# Altium project CabinTempSenseHardware2.PrjPcb
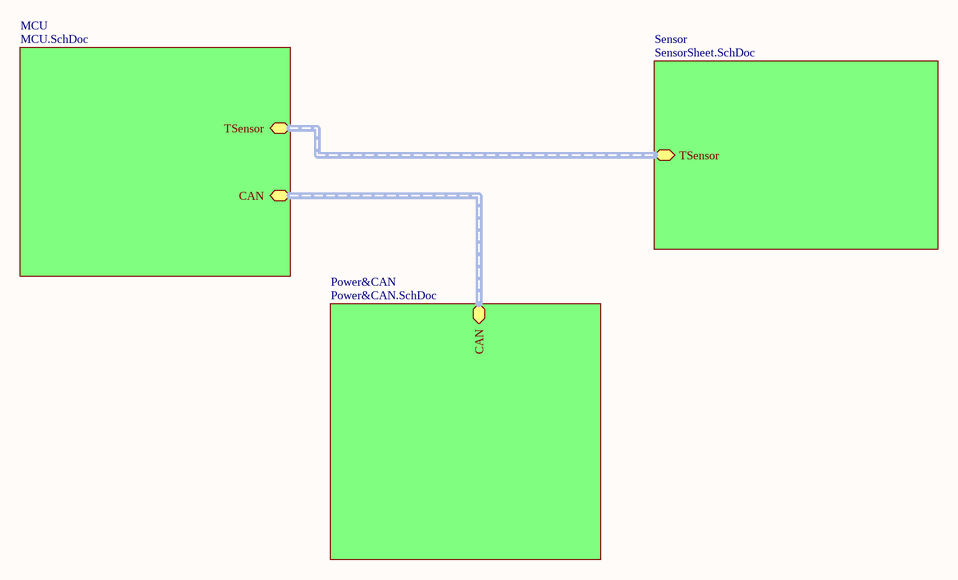
[diagram p0: MainBoard.SchDoc]
4 sheets, 25 parts. Net scope: hierarchical (ports join the sheet entries above them; power ports are global).
Board file: CabinTempSenseHardware2.PcbDoc
Sheets:
  MainBoard.SchDoc
    MCU = MCU.SchDoc
    Sensor = SensorSheet.SchDoc
    Power&CAN = Power&CAN.SchDoc

## Sheet MainBoard.SchDoc
size A4

### Sub-sheets
MCU = MCU.SchDoc: TSensor (harness Sensor), CAN (harness CanHarness)
Power&CAN = Power&CAN.SchDoc: CAN (harness CanHarness)
Sensor = SensorSheet.SchDoc: TSensor (harness Sensor)

### Buses and harness runs
harness sheet MCU/CAN = sheet Power&CAN/CAN
harness sheet MCU/TSensor = sheet Sensor/TSensor

## Sheet MCU.SchDoc
size A4
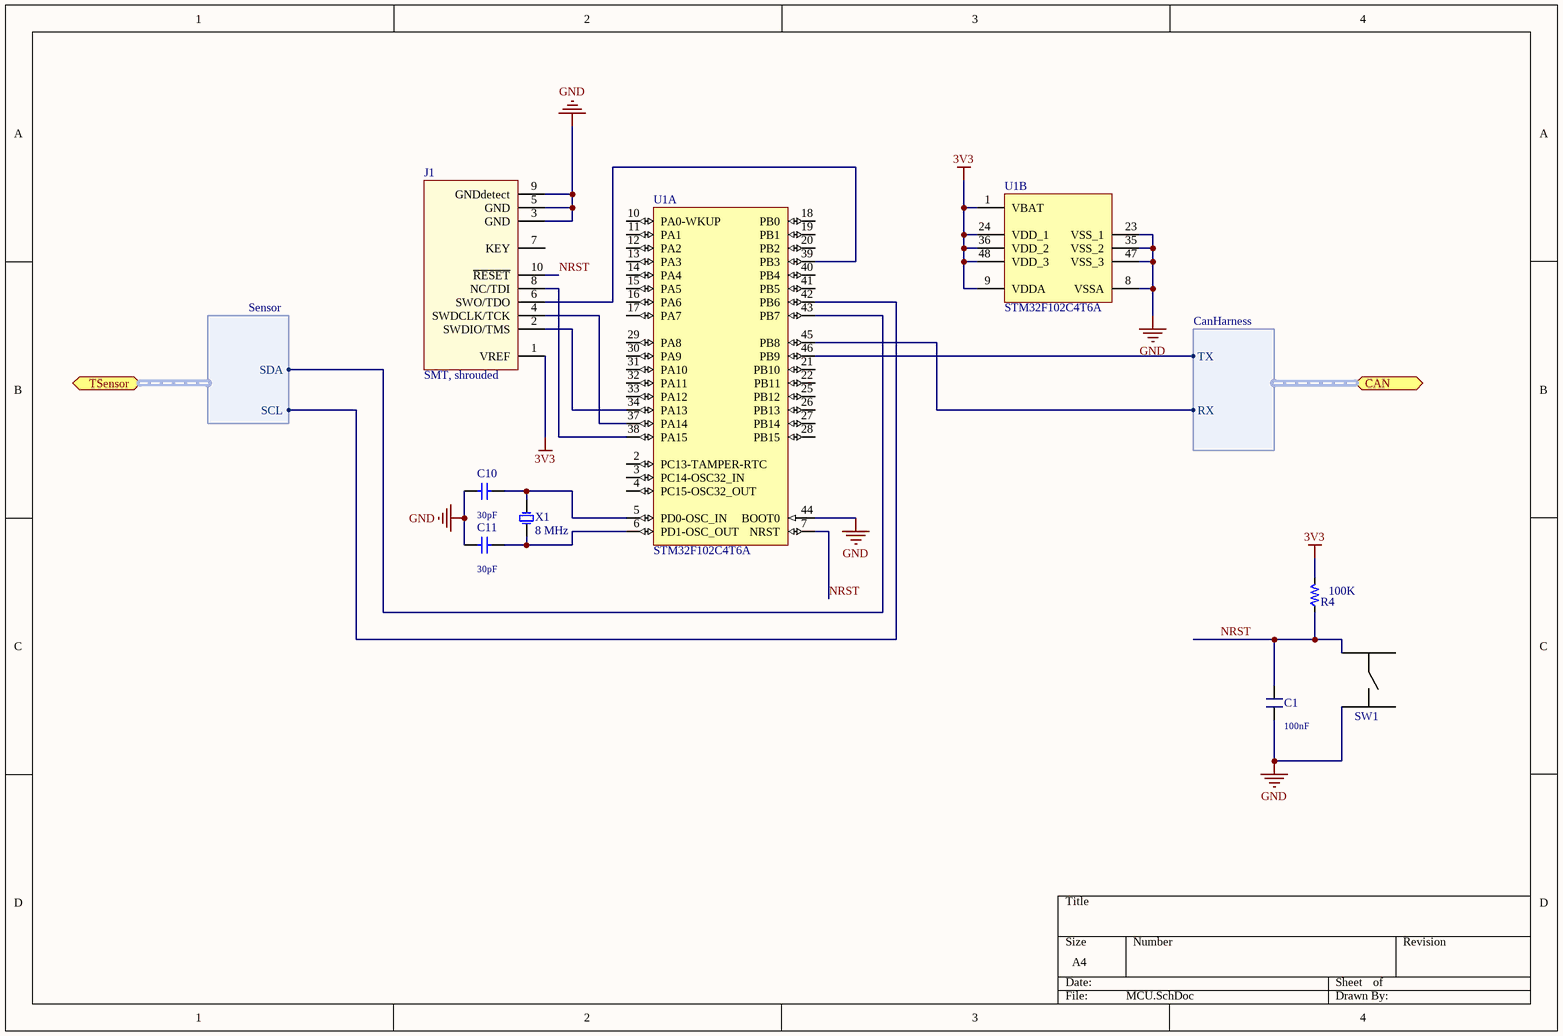
[diagram p1: MCU.SchDoc]

### Parts
C1  Capacitance: 100nF  [PCB_GENERIC_SMD_0603]  (hidden comment: SCH_GENERIC_CAPACITOR_0603)
C10  Capacitance: 30pF  [PCB_GENERIC_SMD_0603]  (hidden comment: SCH_GENERIC_CAPACITOR_0603)
C11  Capacitance: 30pF  [PCB_GENERIC_SMD_0603]  (hidden comment: SCH_GENERIC_CAPACITOR_0603)
J1  SMT, shrouded  [CONN-50mil-10POS-SMD]
R4  Resistance: 100K  [PCB_GENERIC_SMD_0603]  (hidden comment: SCH_GENERIC_RESISTOR_0603)
SW1  Tactile Switch  [C&K 4 pin Tactile Switch]  (value not drawn)
U1  STM32F102C4T6A  [STM-LQFP48_N]  (parts A,B of 2)
X1  8 MHz  [CRYSTAL_8MHZ]

### Ports
CAN (harness CanHarness), TSensor (harness Sensor)

### Harnesses
Sensor: SDA, SCL
CanHarness: TX, RX

### Nets
3V3: J1.1(VREF) R4.2 U1.1(VBAT) U1.9(VDDA) U1.24(VDD_1) U1.36(VDD_2) U1.48(VDD_3)
GND: C1.1 C10.2 C11.2 J1.3(GND) J1.5(GND) J1.9(GNDdetect) SW1.3 U1.8(VSSA) U1.23(VSS_1) U1.35(VSS_2) U1.44(BOOT0) U1.47(VSS_3)
CAN_RX: U1.45(PB8) ; port CAN.RX
CAN_TX: U1.46(PB9) ; port CAN.TX
NRST: C1.2 J1.10(~{RESET}) R4.1 SW1.1 U1.7(NRST)
NetC10_1: C10.1 U1.5(PD0-OSC_IN) X1.2
NetC11_1: C11.1 U1.6(PD1-OSC_OUT) X1.1
NetJ1_2: J1.2(SWDIO/TMS) U1.34(PA13)
NetJ1_4: J1.4(SWDCLK/TCK) U1.37(PA14)
NetJ1_6: J1.6(SWO/TDO) U1.39(PB3)
NetJ1_8: J1.8(NC/TDI) U1.38(PA15)
NetR1_1: U1.42(PB6) ; port TSensor.SCL
NetR2_1: U1.43(PB7) ; port TSensor.SDA

Not connected (* = marked no-connect by the designer): J1 7(KEY); SW1 2 4; U1 2(PC13-TAMPER-RTC) 3(PC14-OSC32_IN) 4(PC15-OSC32_OUT) 10(PA0-WKUP) 11(PA1) 12(PA2) 13(PA3) 14(PA4) 15(PA5) 16(PA6) 17(PA7) 18(PB0) 19(PB1) 20(PB2) 21(PB10) 22(PB11) 25(PB12) 26(PB13) 27(PB14) 28(PB15) 29(PA8) 30(PA9) 31(PA10) 32(PA11) 33(PA12) 40(PB4) 41(PB5)

### Library data of the parts
C1 C11 = SCH_GENERIC_CAPACITOR_0603: Generic SMD capacitor 0603; Tolerance: *%
C10 = SCH_GENERIC_CAPACITOR_0603: Generic SMD capacitor 0603; Tolerance: *%; Voltage: *V
J1 = conn_0.050"_cortexM: ARM Cortex-M 10pin connector,shrouded,SMT; Supplier 1: Digi-Key; Supplier Part Number 1: 1175-1629-ND
R4 = SCH_GENERIC_RESISTOR_0603: Generic SMD resistor 0603
SW1 = C&K Tactile Switch
U1 = STM32F102C4T6A: ARM Cortex-M3 32-bit MCU, 16 KB Flash, 4 KB Internal RAM, 37 I/Os, 48-pin LQFP, -40 to 85 degC, Tray; A/D Converter: 1x12-bit (10 Channel); FLASH Size (Prog) (kB): 16; I/Os (High Current): 37; Internal RAM Size (kB): 4; Operating Frequency(F) (Processor speed) (MHz): 48; Supply Voltage(Vcc) min (V): 2; DatasheetVersion: Rev. 4; PackageVersion: Rev. 6, 06/2013; PackageReference: LQFP48; PackageDescription: 48-Pin Low Profile Quad Flat Package, 7 x 7 mm Body, 0.5 mm Pitch; Supplier 1: Digi-Key; Supplier Part Number 1: 497-8305-ND; Supplier 2: Farnell; Supplier Part Number 2: 2060889; Supplier 3: Newark; Supplier Part Number 3: 65T3771; Supplier 4: Mouser; Supplier Part Number 4: 511-STM32F102C4T6A; Core: ARM Cortex-M3; Packing: Tray; Mounting Technology: Surface Mount; PartNumber: STM32F102C4T6A; ComponentLink1Description: Manufacturer URL; ComponentLink1URL: http://www.st.com/web/en/home.html; ComponentLink2Description: Datasheet; ComponentLink2URL: http://www.st.com/st-web-ui/static/active/en/resource/technical/document/datasheet/CD00210833.pdf; ComponentLink3Description: Package Specification; ComponentLink3URL: http://www.st.com/st-web-ui/static/active/en/resource/technical/document/datasheet/DM00058181.pdf
X1 = XTAL_TH_8MHz: 8MHz ±30ppm 20pF Crystal; Frequency: 8MHz; Supplier 1: Digi-Key; Supplier Part Number 1: 631-1100-ND

## Sheet SensorSheet.SchDoc
size A4
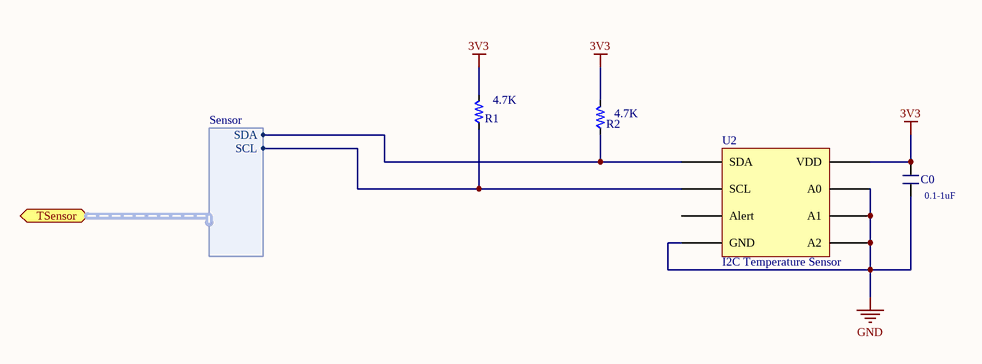
[diagram p2: SensorSheet.SchDoc]

### Parts
C0  Capacitance: 0.1-1uF  [PCB_GENERIC_SMD_0603]  (hidden comment: SCH_GENERIC_CAPACITOR_0603)
R1  Resistance: 4.7K  [PCB_GENERIC_SMD_0603]  (hidden comment: SCH_GENERIC_RESISTOR_0603)
R2  Resistance: 4.7K  [PCB_GENERIC_SMD_0603]  (hidden comment: SCH_GENERIC_RESISTOR_0603)
U2  I2C Temperature Sensor  [SENSOR TEMP I2C/SMBUS 8MSOP]

### Ports
TSensor (harness Sensor)

### Harnesses
Sensor: SCL, SDA

### Nets
3V3: C0.2 R1.2 R2.2 U2.8(VDD)
GND: C0.1 U2.4(GND) U2.5(A2) U2.6(A1) U2.7(A0)
NetR1_1: R1.1 U2.2(SCL) ; port TSensor.SCL
NetR2_1: R2.1 U2.1(SDA) ; port TSensor.SDA

Not connected (* = marked no-connect by the designer): U2 3(Alert)

### Library data of the parts
C0 = SCH_GENERIC_CAPACITOR_0603: as C1 on sheet MCU
R1 R2 = SCH_GENERIC_RESISTOR_0603: Generic SMD resistor 0603
U2 = Temperature Sensor Digital, Local -40°C ~ 125°C 10 b 8-MSOP, Digikey; MCP9808T-E/MSCT-ND Mfg; MCP9808T-E/MS

## Sheet Power&CAN.SchDoc
size A4
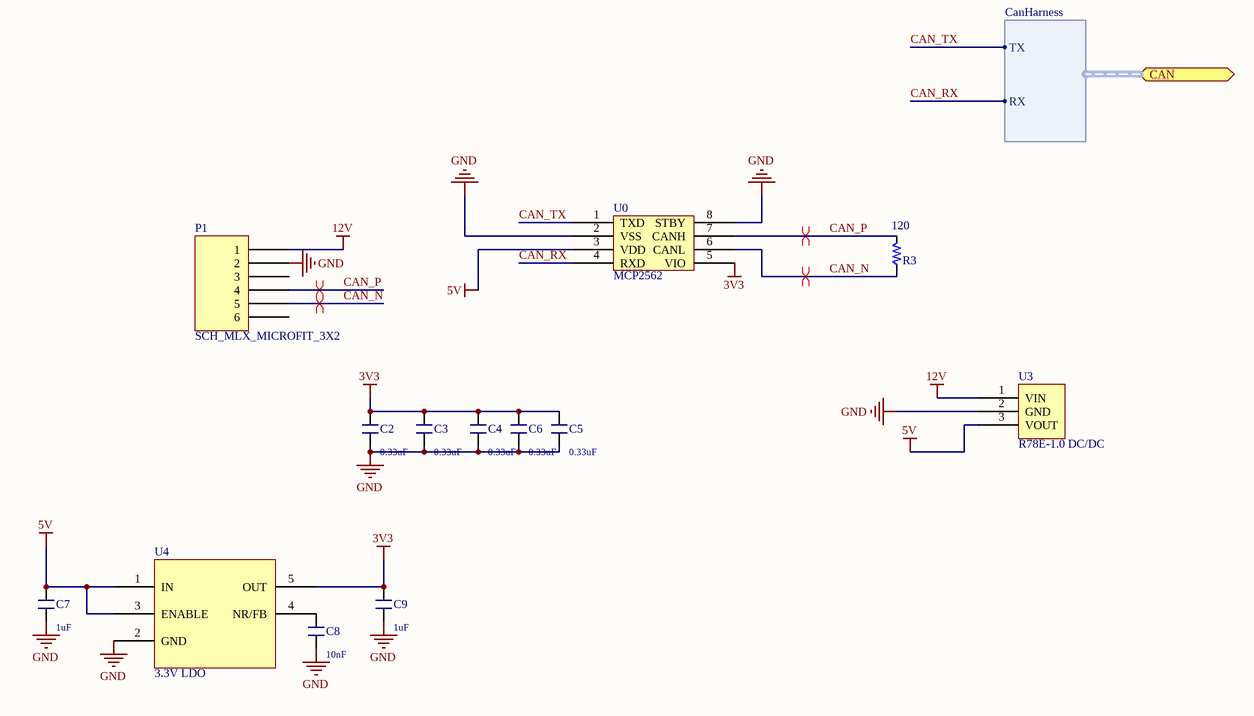
[diagram p3: Power&CAN.SchDoc]

### Parts
C2  Capacitance: 0.33uF  [PCB_GENERIC_SMD_0603]  (hidden comment: SCH_GENERIC_CAPACITOR_0603)
C3  Capacitance: 0.33uF  [PCB_GENERIC_SMD_0603]  (hidden comment: SCH_GENERIC_CAPACITOR_0603)
C4  Capacitance: 0.33uF  [PCB_GENERIC_SMD_0603]  (hidden comment: SCH_GENERIC_CAPACITOR_0603)
C5  Capacitance: 0.33uF  [PCB_GENERIC_SMD_0603]  (hidden comment: SCH_GENERIC_CAPACITOR_0603)
C6  Capacitance: 0.33uF  [PCB_GENERIC_SMD_0603]  (hidden comment: SCH_GENERIC_CAPACITOR_0603)
C7  Capacitance: 1uF  [PCB_GENERIC_SMD_0603]  (hidden comment: SCH_GENERIC_CAPACITOR_0603)
C8  Capacitance: 10nF  [PCB_GENERIC_SMD_0603]  (hidden comment: SCH_GENERIC_CAPACITOR_0603)
C9  Capacitance: 1uF  [PCB_GENERIC_SMD_0603]  (hidden comment: SCH_GENERIC_CAPACITOR_0603)
P1  SCH_MLX_MICROFIT_3X2  [PCB_MLX_MICROFIT_3X2]
R3  Resistance: 120  [PCB_GENERIC_SMD_0603]  (hidden comment: SCH_GENERIC_RESISTOR_0603)
U0  MCP2562  [SOIC127P600X175-8N]
U3  R78E-1.0 DC/DC  [R78-1.0]
U4  3.3V LDO  [SOT95P280X145-5N]

### Ports
CAN (harness CanHarness)

### Harnesses
CanHarness: TX, RX

### Nets
3V3: C2.2 C3.2 C4.2 C5.2 C6.2 C9.2 U0.5(VIO) U4.5(OUT)
5V: C7.2 U0.3(VDD) U3.3(VOUT) U4.1(IN) U4.3(ENABLE)
12V: P1.1 U3.1(VIN)
GND: C2.1 C3.1 C4.1 C5.1 C6.1 C7.1 C8.1 C9.1 P1.2 U0.2(VSS) U0.8(STBY) U3.2(GND) U4.2(GND)
CAN_N: P1.5 R3.1 U0.6(CANL)
CAN_P: P1.4 R3.2 U0.7(CANH)
CAN_RX: U0.4(RXD) ; port CAN.RX
CAN_TX: U0.1(TXD) ; port CAN.TX
NetC8_2: C8.2 U4.4(NR/FB)

Not connected (* = marked no-connect by the designer): P1 3 6

### Layout directives
differential pair: CAN_N, CAN_P

### Library data of the parts
C2-C9 = SCH_GENERIC_CAPACITOR_0603: as C1 on sheet MCU
R3 = SCH_GENERIC_RESISTOR_0603: Generic SMD resistor 0603
U0 = MCP2562: 1/1 Transceiver Full CAN 8-SOIC
U3 = R78E-1.0
U4 = 3V3LDO_TPS73633DBVR_SOT23-5: Linear Voltage Regulator IC Positive Fixed 1 Output 3.3V 400mA SOT-23-5

## Nets that join several sheets
3V3: MCU (7 pins), SensorSheet (C0.2 R1.2 R2.2 U2.8), Power&CAN (8 pins)
GND: MCU (12 pins), SensorSheet (5 pins), Power&CAN (13 pins)
CAN_RX: MCU (U1.45), Power&CAN (U0.4)
CAN_TX: MCU (U1.46), Power&CAN (U0.1)
NetR1_1: MCU (U1.42), SensorSheet (R1.1 U2.2)
NetR2_1: MCU (U1.43), SensorSheet (R2.1 U2.1)